# EAGLE design IOMOD-SW8B-v1_0 (EAGLE 9.7.0)
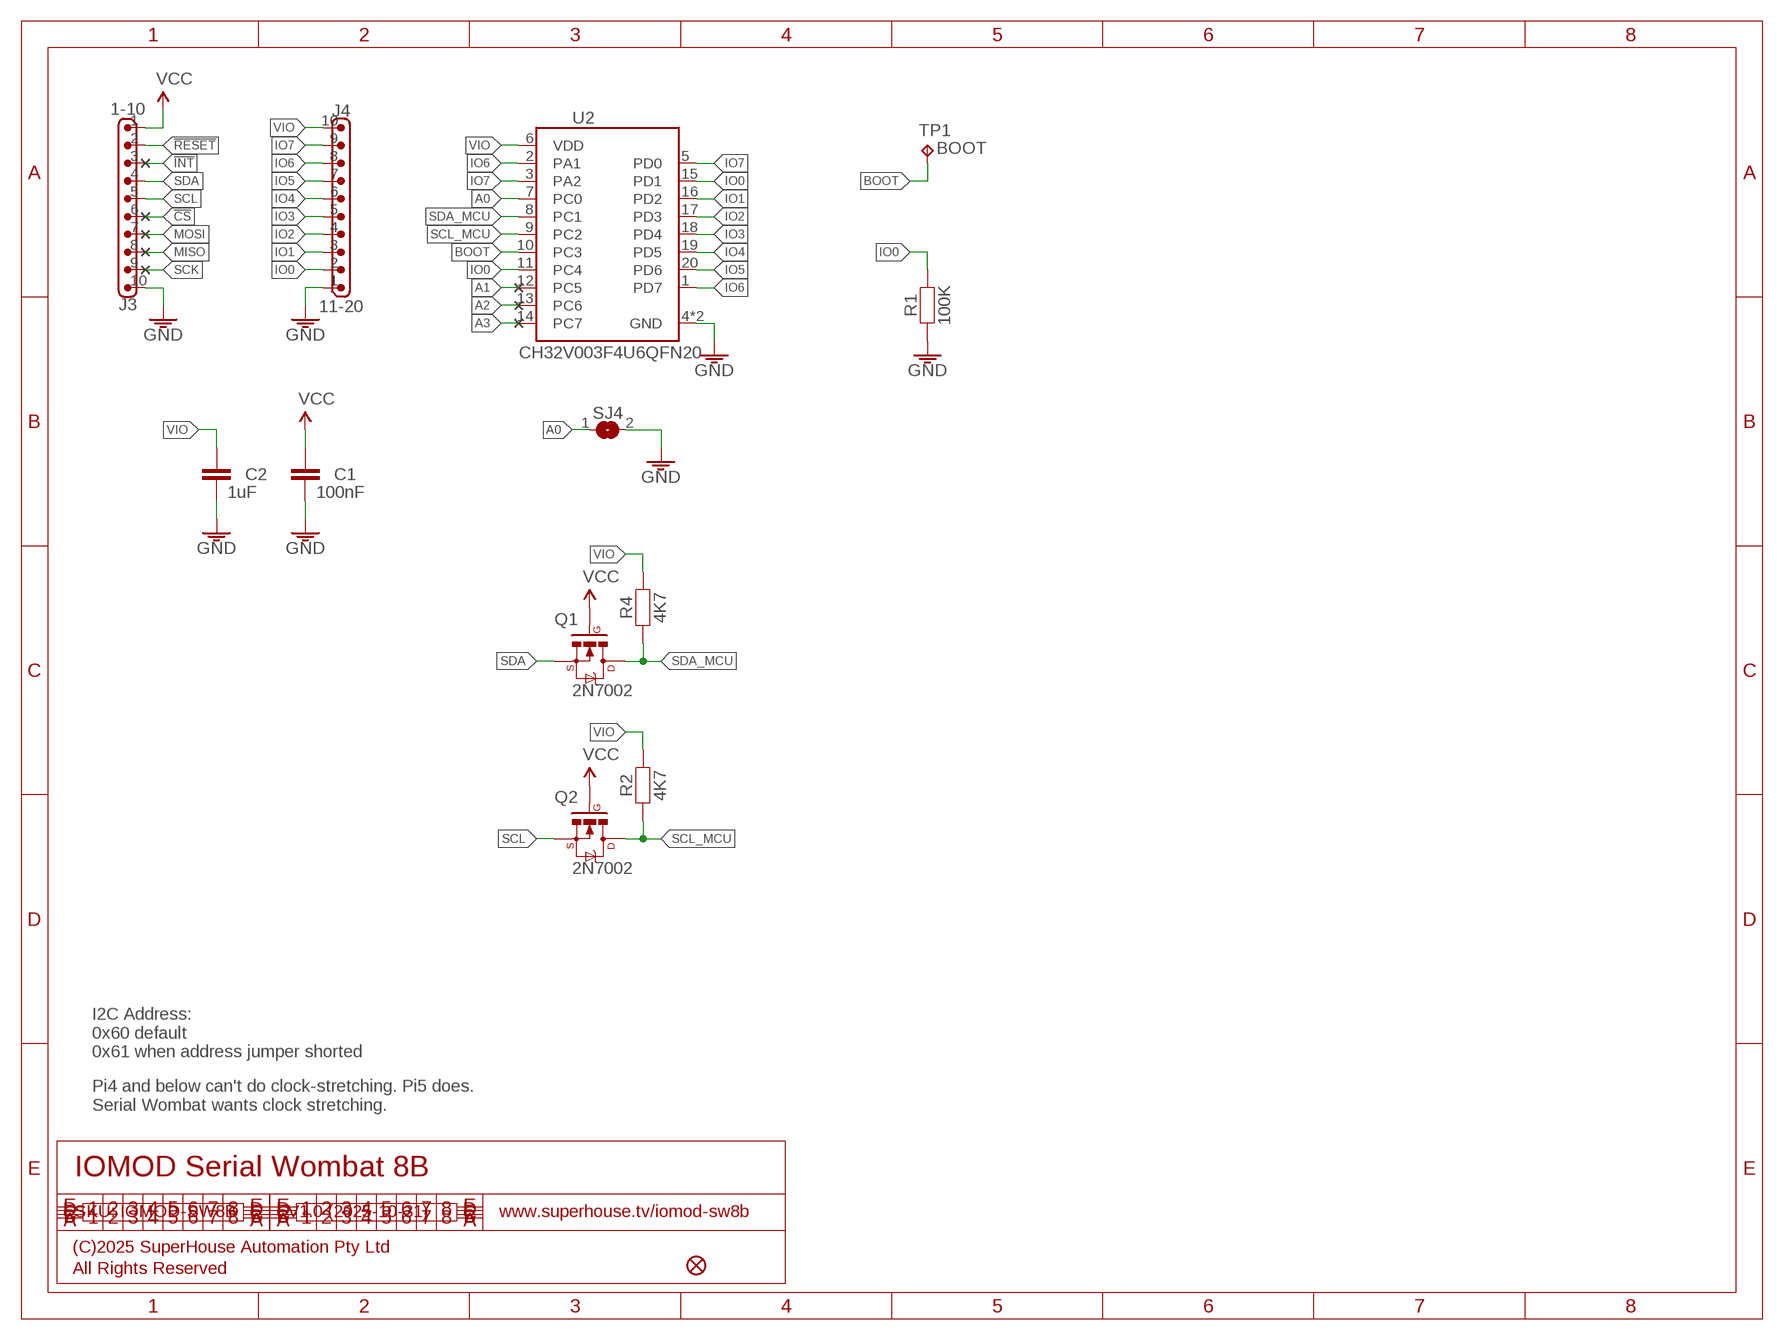
[diagram p0: schematic, sheet 1]

## Parts
C1  100nF  CAP0603  [C0603]
C2  1uF  CAP0603  [C0603]
FID1  FIDUCIAL1X2.5  [FIDUCIAL-1X2.5]
J3  1-10  M10-2.00-P-ABOVE  [1X10-2.00-P-ABOVE]
J4  11-20  M10-2.00-P-ABOVE  [1X10-2.00-P-ABOVE]
Q1  2N7002  MOSFET-NCHANNEL-233  [SOT23-3]
Q2  2N7002  MOSFET-NCHANNEL-233  [SOT23-3]
R1  100K  RESISTOR0603  [R0603]
R2  4K7  RESISTOR0603  [R0603]
R4  4K7  RESISTOR0603  [R0603]
SJ4  SJ-NORMAL  [SJ]
TP1  BOOT  TPB1,27  [B1,27]
U2  CH32V003F4U6QFN20  [QFN-20]

## Nets
!CS: J3.6
!INT: J3.3
!RESET: J3.2
A0: SJ4.1 U2.7(PC0)
A1: U2.12(PC5)
A2: U2.13(PC6)
A3: U2.14(PC7)
BOOT: TP1.TP U2.10(PC3)
GND: C1.2 C2.2 J3.10 J4.1 R1.1 SJ4.2 U2.4(GND) U2.21(GND)
IO0: J4.2 R1.2 U2.11(PC4) U2.15(PD1)
IO1: J4.3 U2.16(PD2)
IO2: J4.4 U2.17(PD3)
IO3: J4.5 U2.18(PD4)
IO4: J4.6 U2.19(PD5)
IO5: J4.7 U2.20(PD6)
IO6: J4.8 U2.1(PD7) U2.2(PA1)
IO7: J4.9 U2.3(PA2) U2.5(PD0)
MISO: J3.8
MOSI: J3.7
SCK: J3.9
SCL: J3.5 Q2.2(S)
SCL_MCU: Q2.3(D) R2.1 U2.9(PC2)
SDA: J3.4 Q1.2(S)
SDA_MCU: Q1.3(D) R4.1 U2.8(PC1)
VCC: C1.1 J3.1 Q1.1(G) Q2.1(G)
VIO: C2.1 J4.10 R2.2 R4.2 U2.6(VDD)

## Notes on the sheet
- I2C Address:
  0x60 default
  0x61 when address jumper shorted
- Pi4 and below can't do clock-stretching. Pi5 does.
  Serial Wombat wants clock stretching.
- IOMOD Serial Wombat 8B
- SKU: IOMOD-SW8B | V1.0 (2025-10-31) | www.superhouse.tv/iomod-sw8b
- (C)2025 SuperHouse Automation Pty Ltd
- All Rights Reserved

## Library data of the parts
C1 C2 = SuperHouse-Capacitors:CAP: Capacitor Standard ceramic capacitor
FID1 = SuperHouse-Symbols:FIDUCIAL: Fiducial Alignment Points Various fiducial points for machine vision alignment.
J3 J4 = SuperHouse-Connectors:M10: 10-way header Standard 1x10 header, and screw terminal variations
Q1 Q2 = SuperHouse-Transistors:MOSFET-NCHANNEL: N-channel MOSFET
R1 R2 R4 = SuperHouse-Resistors:RESISTOR: Resistors in both surface-mount and through-hole versions.
SJ4 = SuperHouse-Jumpers:SJ: SMD solder jumper, normally-open. Add solder to close the connection.
TP1 = SuperHouse-Connectors:TP: Test pad
U2 = SuperHouse-MCUs:CH32V003F4U6

## Net classes
0 Default: width 0.203 mm
1 VCC: width 0.305 mm

## Board
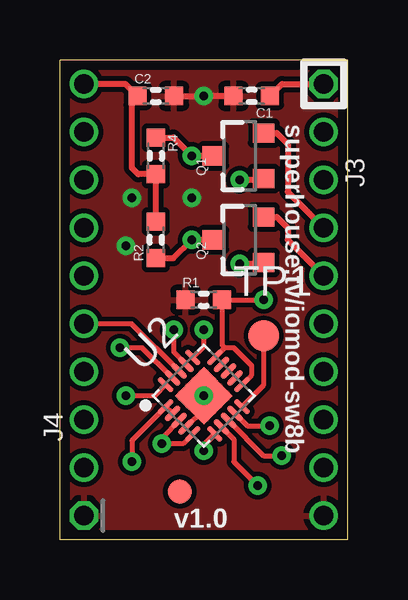
[diagram p1: board, top side]
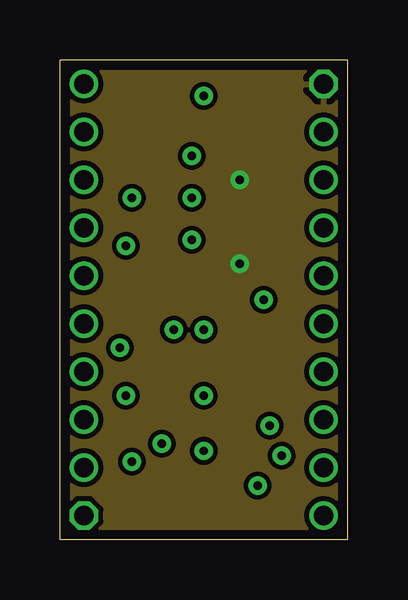
[diagram p2: board, inner layer Route2]
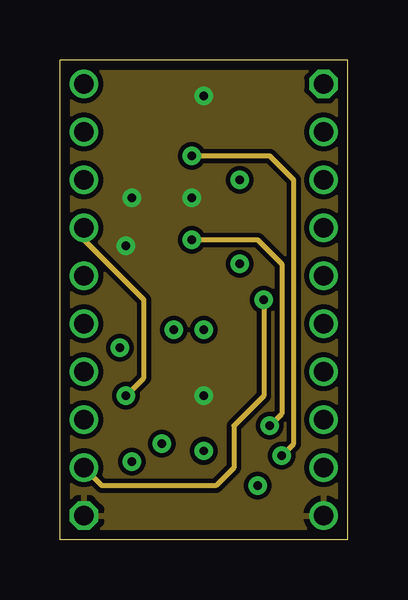
[diagram p3: board, inner layer Route15]
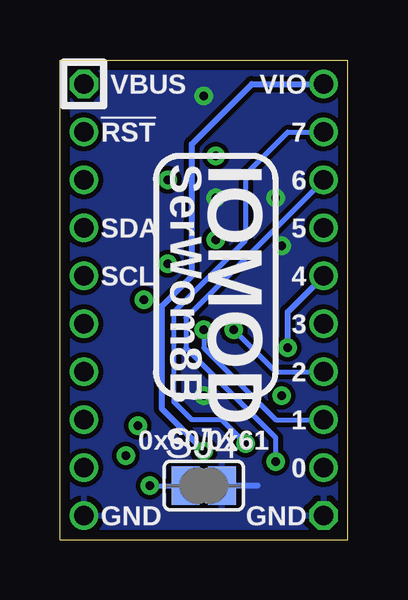
[diagram p4: board, bottom side, seen from below]

Size 12 x 20 mm. Coordinates in mm from the lower left corner, seen from the top.
Outline: 12,0 0,0 0,20 12,20 12,0
Copper layers (1+2*15+16): Top 0.035mm / dielectric 1.5mm / Route2 0.035mm / dielectric 0.15mm / Route15 0.035mm / dielectric 0.2mm / Bottom 0.035mm
Design rules "SuperHouse-Design-Rules *": minimum track width 10mil, minimum drill 24mil, track to track 8mil, track to pad 8mil, pad to pad 8mil, via to via 8mil, smd to smd 6mil, copper to edge 0.4mm, drill to drill 8mil, minimum pad ring 7mil, minimum via ring 8mil, stop-mask expansion 4mil, vias tented up to drill 0.5mm, thermal gap 10mil

### Footprints (pad centres in the part's own frame; a part is rotated, then mirrored left to right if it is on the bottom)
C0603 = smd 0.762 x 0.762: 1 -0.762,0; 2 0.762,0
FIDUCIAL-1X2.5 = smd 1 x 1: 1 0,0
1X10-2.00-P-ABOVE = drill 0.8 octagon: 1 -9,0 | drill 0.8: 2 -7,0; 3 -5,0; 4 -3,0; 5 -1,0; 6 1,0; 7 3,0; 8 5,0; 9 7,0; 10 9,0
SOT23-3 = smd 0.8 x 0.9: 1 -0.95,-1; 2 0.95,-1; 3 0,1.1
R0603 = smd 0.762 x 0.762: 1 -0.762,0; 2 0.762,0
SJ = smd 1.168 x 1.6: 1 -0.762,0; 2 0.762,0
B1,27 = smd 1.27 x 1.27: TP 0,0
QFN-20 = smd 0.817 x 0.237: 1 -1.45,0.8; 2 -1.45,0.4; 3 -1.45,0; 4 -1.45,-0.4; 5 -1.45,-0.8; 11 1.45,-0.8; 12 1.45,-0.4; 13 1.45,0; 14 1.45,0.4; 15 1.45,0.8 | smd 0.237 x 0.817: 6 -0.8,-1.45; 7 -0.4,-1.45; 8 0,-1.45; 9 0.4,-1.45; 10 0.8,-1.45; 16 0.8,1.45; 17 0.4,1.45; 18 0,1.45; 19 -0.4,1.45; 20 -0.8,1.45 | smd 1.7 x 1.7: 21 0,0

### Placement (x,y rotation side)
C1  8,18.5 180 top
C2  4,18.5 0 top
FID1  5,2 0 top
J3  11,10 270 top
J4  1,10 90 top
Q1  7.5,16 90 top
Q2  7.5,12.5 90 top
R1  6,10 0 top
R2  4,12.5 90 top
R4  4,16 270 top
SJ4  6,2.25 0 bottom
TP1  8.5,8.5 0 top
U2  6,6 45 top

### Tracks (layer width: path | path; a pad name or v marks a point on that pad's centre or on a via)
A0  (via drill 0.35)
  Top 0.203: U2.7 7.25,4.18 7.25,3.25 v8.25,2.25
  Bottom 0.203: v8.25,2.25 SJ4.1
BOOT
  Top 0.203: U2.10 8.5,6.45 TP1.TP
GND  (via drill 0.35)
  Top 0.203: U2.4 6,5.43 U2.21
  Top 0.254: C1.2 v6,18.5 C2.2
  Bottom 0.254: 3.75,2.25 SJ4.2
  other vias: 6,6 5.5,14.25 3,14.25 2.75,12.25
  pour Top: 0.04,0.04 11.96,0.04 11.96,19.96 0.04,19.96
  pour Bottom: 0.04,0.04 11.96,0.04 11.96,19.96 0.04,19.96
  pour Route15: 0.08,0.08 11.92,0.08 11.92,19.92 0.08,19.92
IO0  (via drill 0.35)
  Top 0.203: U2.15 6.87,8 | U2.11 8,6.87 8,7.25 7.25,8 6.87,8 | v8.5,10 R1.2 6.76,8.11 6.87,8
  Route15 0.203: v8.5,10 8.5,6 7.25,4.75 7.25,3 6.5,2.25 1.75,2.25 J4.2
IO1  (via drill 0.35)
  Top 0.203: U2.16 6,8.05 v6,8.75
  Bottom 0.203: v6,8.75 6,8 3,5 J4.3
IO2  (via drill 0.35)
  Top 0.203: U2.17 4.75,7.82 v4.75,8.75
  Bottom 0.203: v4.75,8.75 3,7 J4.4
IO3
  Top 0.203: U2.18 3,9 J4.5
IO4  (via drill 0.35)
  Top 0.203: U2.19 3.43,8 v2.5,8
  Bottom 0.254: v2.5,8 2.5,9.5 J4.6
IO5  (via drill 0.35)
  Top 0.203: U2.20 3.95,6 v2.75,6
  Route15 0.203: v2.75,6 3.5,6.75 3.5,10 1,12.5 J4.7
IO6  (via drill 0.35)
  Top 0.203: U2.2 U2.1 3,4.13 v3,3.25
  Bottom 0.203: v3,3.25 3,4.25 6.75,8 6.75,9.25 J4.8
IO7  (via drill 0.35)
  Top 0.203: U2.5 5.13,4 v4.25,4 4.25,4.25 U2.3
  Bottom 0.203: v4.25,4 5.25,5 6.5,5 7.25,5.75 7.25,9.5 4.25,12.5 4.25,15.25 2.5,17 J4.9
SCL
  Top 0.254: Q2.2 9.05,13.45 9.5,13 9.5,12.5 J3.5
SCL_MCU  (via drill 0.35)
  Top 0.203: U2.9 7.82,4.75 v8.75,4.75
  Top 0.254: Q2.3 v5.5,12.5 4.74,11.74 R2.1
  Route15 0.203: v8.75,4.75 9.25,5.25 9.25,11.5 8.25,12.5 v5.5,12.5
SDA
  Top 0.254: Q1.2 9.05,16.95 9.5,16.5 9.5,14.5 J3.4
SDA_MCU  (via drill 0.35)
  Top 0.203: U2.8 8.5,3.5 v9.25,3.5
  Top 0.254: 6.4,16.1 Q1.3 v5.5,16 4.74,16.76 R4.1
  Route15 0.203: v9.25,3.5 9.75,4 9.75,15 8.75,16 v5.5,16
VCC  (via drill 0.35)
  Top 0.254: C1.1 9.26,19 J3.1 | Q2.1 8.45,11.5 v7.5,11.5 | Q1.1 8.45,15 v7.5,15
  pour Route2: 0.08,0.08 11.92,0.08 11.92,19.92 0.08,19.92
VIO  (via drill 0.35)
  Top 0.254: J4.10 2.74,19 C2.1 3,18.26 3,15.5 3.26,15.24 R4.2 R2.2 | U2.6 6,3.95 v6,3.7
  Bottom 0.254: v6,3.7 7.75,5.45 7.75,9.75 6.5,11 6.5,16.5 4,19 J4.10

### Text on the board
tPlace: superhouse.tv/iomod-sw8b | v1.0
bPlace: VIO | VBUS | 7 | !RST | IOMOD | SerWom8B | 6 | 5 | SDA | 4 | SCL | 3 | 2 | 1 | 0x60/0x61 | 0 | GND | GND